# Altium schematic sheet EDFA Connector.SchDoc
size 99 x 63 mm
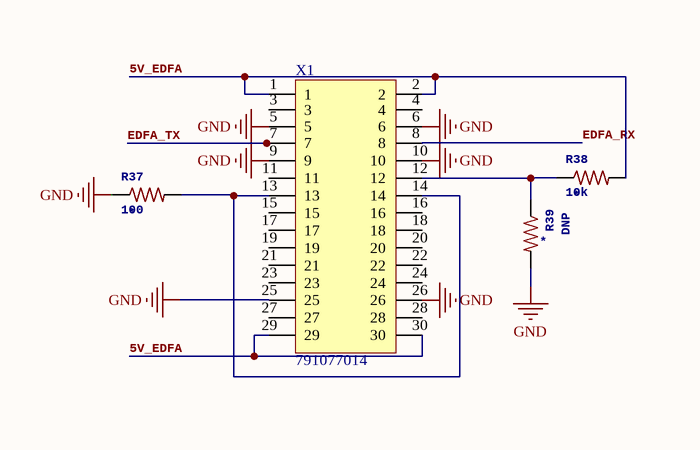
[diagram p0: EDFA Connector.SchDoc]

## Parts
R37  100  [0603R]
R38  10k  [0603R]
R39  DNP  [0603R]
X1  791077014  [791077014]

## Nets
GND: R37.1 R39.2 X1.5 X1.6 X1.9 X1.10 X1.25 X1.26
5V_EDFA: R38.2 X1.1 X1.2 X1.29 X1.30
EDFA_RX: X1.8
EDFA_TX: X1.7
NetR37_2: R37.2 X1.13 X1.14
NetR38_1: R38.1 R39.1 X1.12

Not connected (* = marked no-connect by the designer): X1 3 4 11 15 16 17 18 19 20 21 22 23 24 27 28

## Library data of the parts
R37-R39 = R-US_R0603: RESISTOR, American symbol; GateName_1: G$1; SymbolName_1: R-US; DeviceName: R0603; DeviceSetName: R-US_; LibraryName: rcl; NAME: *